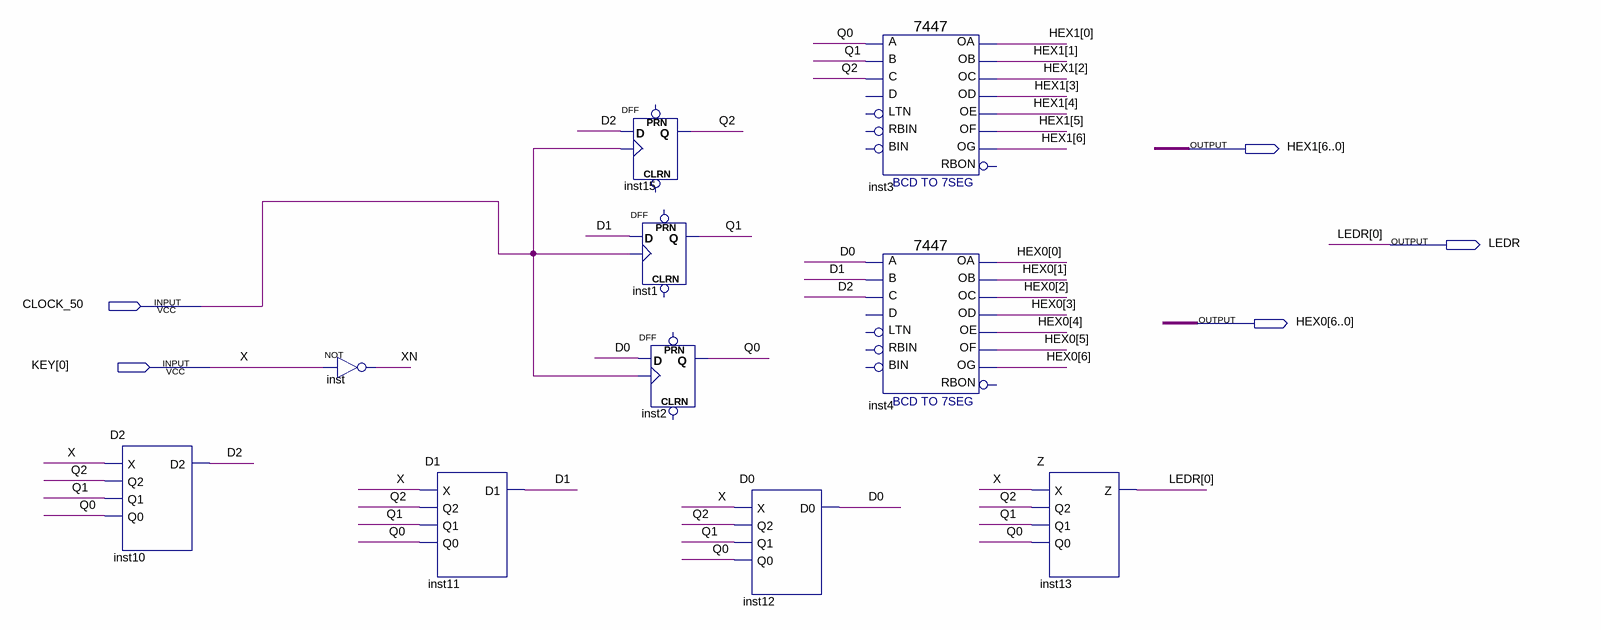
[diagram p0: schematic sheet]
// Quartus schematic Lab02_moore.bdf as structural Verilog: 10 symbols, 5 pins
module Lab02_moore (
  input  CLOCK_50,
  input  [0:0] KEY,
  output [6:0] HEX1,
  output LEDR,
  output [6:0] HEX0
);

  wire D0, D1, D2, Q0, Q1, Q2, XN;

  D2 inst10 (.X(KEY[0]), .Q2(Q2), .Q1(Q1), .Q0(Q0), .D2(D2));
  not inst (XN, KEY[0]);
  D1 inst11 (.X(KEY[0]), .Q2(Q2), .Q1(Q1), .Q0(Q0), .D1(D1));
  DFF inst15 (.CLK(CLOCK_50), .D(D2), .Q(Q2));  // open: CLRN, PRN
  DFF inst1 (.CLK(CLOCK_50), .D(D1), .Q(Q1));  // open: CLRN, PRN
  DFF inst2 (.CLK(CLOCK_50), .D(D0), .Q(Q0));  // open: CLRN, PRN
  D0 inst12 (.X(KEY[0]), .Q2(Q2), .Q1(Q1), .Q0(Q0), .D0(D0));
  \7447  inst3 (
    .B(Q1), .C(Q2), .A(Q0), .OB(HEX1[1]), .OC(HEX1[2]), .OE(HEX1[4]), .OD(HEX1[3]), .OF(HEX1[5]),
    .OG(HEX1[6]), .OA(HEX1[0]));  // open: LTN, D, RBIN, BIN, RBON
  \7447  inst4 (
    .B(D1), .C(D2), .A(D0), .OB(HEX0[1]), .OC(HEX0[2]), .OE(HEX0[4]), .OD(HEX0[3]), .OF(HEX0[5]),
    .OG(HEX0[6]), .OA(HEX0[0]));  // open: LTN, D, RBIN, BIN, RBON
  Z inst13 (.X(KEY[0]), .Q2(Q2), .Q1(Q1), .Q0(Q0), .Z(LEDR));

  // Other names for the same wires on the sheet: LEDR[0] = LEDR; X = KEY[0]
endmodule
